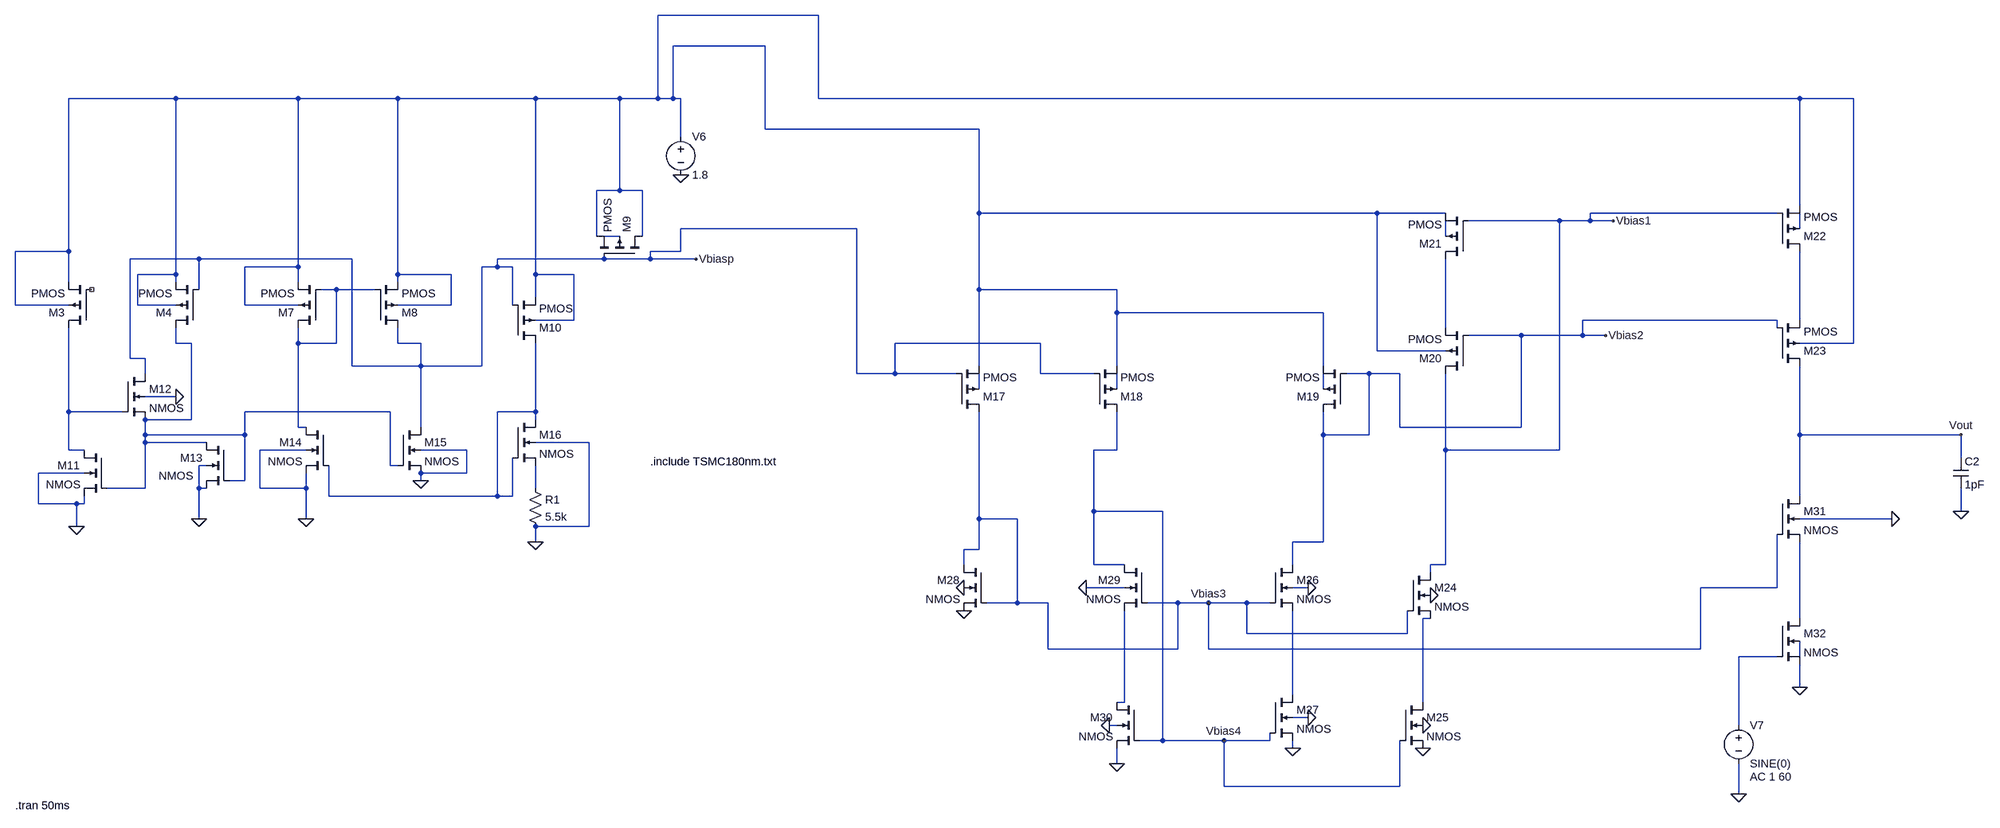
[diagram p0: schematic cascade_180nm.asc]
cascade_180nm.asc, the LTspice schematic file:
Version 4
SHEET 1 6296 680
WIRE -1056 -1072 -1392 -1072
WIRE -1168 -1008 -1360 -1008
WIRE -2400 -896 -2624 -896
WIRE -2144 -896 -2400 -896
WIRE -1936 -896 -2144 -896
WIRE -1648 -896 -1936 -896
WIRE -1472 -896 -1648 -896
WIRE -1392 -896 -1392 -1072
WIRE -1392 -896 -1472 -896
WIRE -1360 -896 -1360 -1008
WIRE -1360 -896 -1392 -896
WIRE -1344 -896 -1360 -896
WIRE -1056 -896 -1056 -1072
WIRE 1120 -896 -1056 -896
WIRE 1232 -896 1120 -896
WIRE -1168 -832 -1168 -1008
WIRE -720 -832 -1168 -832
WIRE -1344 -816 -1344 -896
WIRE -1472 -704 -1472 -896
WIRE -1472 -704 -1520 -704
WIRE -1424 -704 -1472 -704
WIRE 1120 -672 1120 -896
WIRE -720 -656 -720 -832
WIRE 112 -656 -720 -656
WIRE 256 -656 112 -656
WIRE 1072 -656 560 -656
WIRE 496 -640 304 -640
WIRE 560 -640 560 -656
WIRE 560 -640 496 -640
WIRE 608 -640 560 -640
WIRE -976 -624 -1344 -624
WIRE 1120 -624 1120 -656
WIRE -1520 -608 -1520 -704
WIRE -1472 -608 -1504 -608
WIRE -1424 -608 -1424 -704
WIRE 256 -608 256 -640
WIRE -2624 -576 -2624 -896
WIRE -2624 -576 -2736 -576
WIRE -1344 -576 -1344 -624
WIRE -1344 -576 -1408 -576
WIRE -2352 -560 -2496 -560
WIRE -2032 -560 -2352 -560
WIRE -1504 -560 -1728 -560
WIRE -1408 -560 -1408 -576
WIRE -1408 -560 -1504 -560
WIRE -1312 -560 -1408 -560
WIRE -2144 -544 -2144 -896
WIRE -2144 -544 -2256 -544
WIRE -1728 -544 -1728 -560
WIRE -1728 -544 -1760 -544
WIRE -1696 -544 -1728 -544
WIRE -2400 -528 -2400 -896
WIRE -2400 -528 -2480 -528
WIRE -1936 -528 -1936 -896
WIRE -1824 -528 -1936 -528
WIRE -1648 -528 -1648 -896
WIRE -1568 -528 -1648 -528
WIRE -2624 -512 -2624 -576
WIRE -2400 -512 -2400 -528
WIRE -2144 -512 -2144 -544
WIRE -1936 -512 -1936 -528
WIRE -2352 -496 -2352 -560
WIRE -2064 -496 -2096 -496
WIRE -1984 -496 -2064 -496
WIRE -720 -496 -720 -656
WIRE -432 -496 -720 -496
WIRE -1648 -480 -1648 -528
WIRE -2736 -464 -2736 -576
WIRE -2624 -464 -2736 -464
WIRE -2480 -464 -2480 -528
WIRE -2400 -464 -2480 -464
WIRE -2256 -464 -2256 -544
WIRE -2144 -464 -2256 -464
WIRE -1824 -464 -1824 -528
WIRE -1824 -464 -1936 -464
WIRE -1696 -464 -1696 -544
WIRE -432 -448 -432 -496
WIRE 0 -448 -432 -448
WIRE -1568 -432 -1568 -528
WIRE -1568 -432 -1648 -432
WIRE 1072 -432 544 -432
WIRE 1120 -432 1120 -576
WIRE 256 -416 256 -560
WIRE 1072 -416 1072 -432
WIRE 416 -400 304 -400
WIRE 544 -400 544 -432
WIRE 544 -400 416 -400
WIRE 592 -400 544 -400
WIRE -2400 -384 -2400 -416
WIRE -2368 -384 -2400 -384
WIRE -2144 -384 -2144 -416
WIRE -2064 -384 -2064 -496
WIRE -2064 -384 -2144 -384
WIRE -1936 -384 -1936 -416
WIRE -1888 -384 -1936 -384
WIRE -592 -384 -896 -384
WIRE 1232 -384 1232 -896
WIRE 1232 -384 1120 -384
WIRE 112 -368 112 -656
WIRE 256 -368 112 -368
WIRE -2496 -352 -2496 -560
WIRE -2464 -352 -2496 -352
WIRE -2032 -336 -2032 -560
WIRE -1888 -336 -1888 -384
WIRE -1888 -336 -2032 -336
WIRE -1760 -336 -1760 -544
WIRE -1760 -336 -1888 -336
WIRE -720 -336 -720 -496
WIRE -432 -336 -432 -448
WIRE 0 -336 0 -448
WIRE -2464 -320 -2464 -352
WIRE -976 -320 -976 -624
WIRE -896 -320 -896 -384
WIRE -896 -320 -976 -320
WIRE -768 -320 -896 -320
WIRE -592 -320 -592 -384
WIRE -480 -320 -592 -320
WIRE 96 -320 48 -320
WIRE 160 -320 96 -320
WIRE -720 -288 -720 -320
WIRE -432 -288 -432 -320
WIRE 0 -288 0 -320
WIRE -2400 -272 -2464 -272
WIRE -2624 -240 -2624 -416
WIRE -2512 -240 -2624 -240
WIRE -1952 -240 -2256 -240
WIRE -1648 -240 -1648 -384
WIRE -1648 -240 -1728 -240
WIRE -2368 -224 -2368 -384
WIRE -2368 -224 -2464 -224
WIRE -1648 -224 -1648 -240
WIRE -2144 -208 -2144 -384
WIRE -2128 -208 -2144 -208
WIRE -1888 -208 -1888 -336
WIRE 160 -208 160 -320
WIRE 416 -208 416 -400
WIRE 416 -208 160 -208
WIRE -2464 -192 -2464 -224
WIRE -2256 -192 -2256 -240
WIRE -2256 -192 -2464 -192
WIRE 0 -192 0 -240
WIRE 96 -192 96 -320
WIRE 96 -192 0 -192
WIRE 1120 -192 1120 -336
WIRE 1632 -192 1120 -192
WIRE -2464 -176 -2464 -192
WIRE -2336 -176 -2464 -176
WIRE -1536 -176 -1648 -176
WIRE -2624 -160 -2624 -240
WIRE -2592 -160 -2624 -160
WIRE -2128 -160 -2224 -160
WIRE -1792 -160 -1888 -160
WIRE -432 -160 -432 -240
WIRE -432 -160 -480 -160
WIRE 256 -160 256 -320
WIRE 496 -160 496 -640
WIRE 496 -160 256 -160
WIRE 1632 -144 1632 -192
WIRE -2336 -128 -2352 -128
WIRE -1952 -128 -1952 -240
WIRE -1936 -128 -1952 -128
WIRE -2592 -112 -2688 -112
WIRE -1792 -112 -1792 -160
WIRE -1792 -112 -1888 -112
WIRE -2256 -96 -2256 -192
WIRE -2256 -96 -2288 -96
WIRE -1888 -96 -1888 -112
WIRE -2464 -80 -2464 -176
WIRE -2464 -80 -2544 -80
WIRE -2352 -80 -2352 -128
WIRE -2336 -80 -2352 -80
WIRE -2224 -80 -2224 -160
WIRE -2128 -80 -2128 -112
WIRE -2128 -80 -2224 -80
WIRE -1648 -80 -1648 -128
WIRE -2080 -64 -2080 -128
WIRE -1728 -64 -1728 -240
WIRE -1728 -64 -2080 -64
WIRE -1696 -64 -1696 -144
WIRE -1696 -64 -1728 -64
WIRE 1120 -64 1120 -192
WIRE -2688 -48 -2688 -112
WIRE -2608 -48 -2688 -48
WIRE -2592 -48 -2592 -64
WIRE -2592 -48 -2608 -48
WIRE -480 -32 -480 -160
WIRE -336 -32 -480 -32
WIRE 1632 -32 1632 -80
WIRE -2352 -16 -2352 -80
WIRE -2128 -16 -2128 -80
WIRE -720 -16 -720 -240
WIRE -640 -16 -720 -16
WIRE 1312 -16 1120 -16
WIRE -2608 0 -2608 -48
WIRE -1536 0 -1536 -176
WIRE -1536 0 -1648 0
WIRE -1648 32 -1648 0
WIRE 0 32 0 -192
WIRE 0 32 -64 32
WIRE -720 48 -720 -16
WIRE -720 48 -752 48
WIRE -752 80 -752 48
WIRE -480 80 -480 -32
WIRE -416 80 -480 80
WIRE -64 80 -64 32
WIRE 256 80 256 -160
WIRE 256 80 224 80
WIRE 224 96 224 80
WIRE -416 128 -496 128
WIRE -32 128 -64 128
WIRE 1072 128 1072 16
WIRE 1072 128 912 128
WIRE -640 160 -640 -16
WIRE -640 160 -704 160
WIRE -576 160 -640 160
WIRE -304 160 -368 160
WIRE -240 160 -304 160
WIRE -160 160 -240 160
WIRE -112 160 -160 160
WIRE 224 192 208 192
WIRE 1120 192 1120 32
WIRE -160 224 -160 160
WIRE 176 224 176 176
WIRE 176 224 -160 224
WIRE -576 256 -576 160
WIRE -304 256 -304 160
WIRE -304 256 -576 256
WIRE -240 256 -240 160
WIRE 912 256 912 128
WIRE 912 256 -240 256
WIRE 1072 272 992 272
WIRE 1120 272 1120 240
WIRE 1120 336 1120 288
WIRE -64 352 -64 176
WIRE -416 368 -416 176
WIRE -416 368 -432 368
WIRE 208 368 208 192
WIRE -32 400 -64 400
WIRE -432 416 -448 416
WIRE 992 416 992 272
WIRE -336 448 -336 -32
WIRE -336 448 -384 448
WIRE -208 448 -336 448
WIRE -112 448 -112 432
WIRE -112 448 -208 448
WIRE -64 464 -64 448
WIRE -432 496 -432 464
WIRE -208 544 -208 448
WIRE 160 544 160 448
WIRE 160 544 -208 544
WIRE 992 560 992 496
FLAG -2608 0 0
FLAG -2352 -16 0
FLAG -2128 -16 0
FLAG -1648 32 0
FLAG -1888 -96 0
FLAG -2400 -272 0
FLAG 1632 -32 0
FLAG -752 176 0
FLAG -752 128 0
FLAG -448 416 0
FLAG -432 496 0
FLAG -32 128 0
FLAG -496 128 0
FLAG -64 464 0
FLAG -32 400 0
FLAG 208 464 0
FLAG 208 416 0
FLAG 224 144 0
FLAG 1312 -16 0
FLAG 1120 336 0
FLAG 992 560 0
FLAG -1344 -736 0
FLAG 608 -640 Vbias1
FLAG 592 -400 Vbias2
FLAG 1632 -192 Vout
FLAG -240 160 Vbias3
FLAG -208 448 Vbias4
FLAG -1312 -560 Vbiasp
SYMBOL pmos4 -2576 -416 R180
SYMATTR InstName M3
SYMATTR Value2 l=4.32u w=0.36u
SYMBOL pmos4 -2352 -416 R180
SYMATTR InstName M4
SYMATTR Value2 l=4.32u w=0.36u
SYMBOL pmos4 -2096 -416 R180
SYMATTR InstName M7
SYMATTR Value2 l=4.32u w=0.36u
SYMBOL pmos4 -1984 -416 M180
SYMATTR InstName M8
SYMATTR Value2 l=4.32u w=0.36u
SYMBOL pmos4 -1424 -560 M270
SYMATTR InstName M9
SYMATTR Value2 l=4.32u w=0.36u
SYMBOL pmos4 -1696 -384 M180
SYMATTR InstName M10
SYMATTR Value2 l=4.32u w=0.36u
SYMBOL nmos4 -2544 -160 M0
SYMATTR InstName M11
SYMATTR Value2 l=1.8u w=0.36u
SYMBOL nmos4 -2512 -320 R0
SYMATTR InstName M12
SYMATTR Value2 l=1.8u w=0.36u
SYMBOL nmos4 -2288 -176 M0
WINDOW 3 76 70 Left 2
SYMATTR InstName M13
SYMATTR Value2 l=1.8u w=0.36u
SYMBOL nmos4 -2080 -208 M0
SYMATTR InstName M14
SYMATTR Value2 l=1.8u w=0.36u
SYMBOL nmos4 -1936 -208 R0
SYMATTR InstName M15
SYMATTR Value2 l=1.8u w=0.36u
SYMBOL nmos4 -1696 -224 R0
SYMATTR InstName M16
SYMATTR Value2 l=1.8u w=0.36u
SYMBOL res -1664 -96 R0
SYMATTR InstName R1
SYMATTR Value 5.5k
SYMBOL voltage -1344 -832 R0
WINDOW 123 0 0 Left 0
WINDOW 39 0 0 Left 0
SYMATTR InstName V6
SYMATTR Value 1.8
SYMBOL pmos4 -768 -240 M180
SYMATTR InstName M17
SYMATTR Value2 l=4.32u w=0.36u
SYMBOL pmos4 -480 -240 M180
SYMATTR InstName M18
SYMATTR Value2 l=4.32u w=0.36u
SYMBOL pmos4 48 -240 R180
SYMATTR InstName M19
SYMATTR Value2 l=4.32u w=0.36u
SYMBOL pmos4 304 -320 R180
SYMATTR InstName M20
SYMATTR Value2 l=4.32u w=0.36u
SYMBOL pmos4 304 -560 R180
SYMATTR InstName M21
SYMATTR Value2 l=4.32u w=0.36u
SYMBOL pmos4 1072 -576 M180
SYMATTR InstName M22
SYMATTR Value2 l=4.32u w=0.36u
SYMBOL pmos4 1072 -336 M180
SYMATTR InstName M23
SYMATTR Value2 l=4.32u w=0.36u
SYMBOL nmos4 176 96 R0
SYMATTR InstName M24
SYMATTR Value2 l=1.8u w=0.36u
SYMBOL nmos4 160 368 R0
SYMATTR InstName M25
SYMATTR Value2 l=1.8u w=0.36u
SYMBOL nmos4 -112 80 R0
SYMATTR InstName M26
SYMATTR Value2 l=1.8u w=0.36u
SYMBOL nmos4 -112 352 R0
SYMATTR InstName M27
SYMATTR Value2 l=1.8u w=0.36u
SYMBOL nmos4 -704 80 M0
SYMATTR InstName M28
SYMATTR Value2 l=1.8u w=0.36u
SYMBOL nmos4 -368 80 M0
SYMATTR InstName M29
SYMATTR Value2 l=1.8u w=0.36u
SYMBOL nmos4 -384 368 M0
SYMATTR InstName M30
SYMATTR Value2 l=1.8u w=0.36u
SYMBOL nmos4 1072 -64 R0
SYMATTR InstName M31
SYMATTR Value2 l=1.8u w=0.36u
SYMBOL nmos4 1072 192 R0
SYMATTR InstName M32
SYMATTR Value2 l=1.8u w=0.36u
SYMBOL cap 1616 -144 R0
SYMATTR InstName C2
SYMATTR Value 1pF
SYMBOL voltage 992 400 R0
WINDOW 123 24 124 Left 2
WINDOW 39 0 0 Left 0
SYMATTR Value2 AC 1 60
SYMATTR InstName V7
SYMATTR Value SINE(0)
TEXT -1408 -136 Left 2 !.include TSMC180nm.txt
TEXT -2736 584 Left 2 !.tran 50ms

The netlist it stands for:
* cascade_180nm.asc
M3 N012 NC_01 N001 N001 PMOS l=4.32u w=0.36u
M4 N008 Vbiasp N001 N001 PMOS l=4.32u w=0.36u
M7 N005 N005 N001 N001 PMOS l=4.32u w=0.36u
M8 Vbiasp N005 N001 N001 PMOS l=4.32u w=0.36u
M9 N001 Vbiasp N001 N003 PMOS l=4.32u w=0.36u
M10 N013 Vbiasp N001 N001 PMOS l=4.32u w=0.36u
M11 N012 N008 0 0 NMOS l=1.8u w=0.36u
M12 Vbiasp N012 N008 0 NMOS l=1.8u w=0.36u
M13 N008 N008 0 0 NMOS l=1.8u w=0.36u
M14 N005 N013 0 0 NMOS l=1.8u w=0.36u
M15 Vbiasp N008 0 0 NMOS l=1.8u w=0.36u
M16 N013 N013 N014 0 NMOS l=1.8u w=0.36u
R1 N014 0 5.5k
V6 N001 0 1.8
M17 Vbias3 Vbiasp N001 N009 PMOS l=4.32u w=0.36u
M18 Vbias4 Vbiasp N001 N010 PMOS l=4.32u w=0.36u
M19 Vbias2 Vbias2 N001 N011 PMOS l=4.32u w=0.36u
M20 Vbias1 Vbias2 N007 N001 PMOS l=4.32u w=0.36u
M21 N007 Vbias1 N001 N004 PMOS l=4.32u w=0.36u
M22 N006 Vbias1 N001 N002 PMOS l=4.32u w=0.36u
M23 Vout Vbias2 N006 N001 PMOS l=4.32u w=0.36u
M24 Vbias1 Vbias3 N015 0 NMOS l=1.8u w=0.36u
M25 N015 Vbias4 0 0 NMOS l=1.8u w=0.36u
M26 Vbias2 Vbias3 N019 0 NMOS l=1.8u w=0.36u
M27 N019 Vbias4 0 0 NMOS l=1.8u w=0.36u
M28 Vbias3 Vbias3 0 0 NMOS l=1.8u w=0.36u
M29 Vbias4 Vbias3 N020 0 NMOS l=1.8u w=0.36u
M30 N020 Vbias4 0 0 NMOS l=1.8u w=0.36u
M31 Vout Vbias3 N016 0 NMOS l=1.8u w=0.36u
M32 N016 N017 0 N018 NMOS l=1.8u w=0.36u
C2 Vout 0 1pF
V7 N017 0 SINE(0) AC 1 60
.model NMOS NMOS
.model PMOS PMOS
.lib standard.mos
.include TSMC180nm.txt
.tran 50ms
.backanno
.end